# Altium schematic sheet Main.SchDoc: Three Phase ACIM Motor Control
size A3; Date: 28.08.2010; ApprovedBy: V.Gyurov; CheckedBy: V.Gyurov; Author: V.Gyurov; CompanyName: V.Gyurov; DrawnBy: V.Gyurov; Engineer: V.Gyurov; DocumentNumber: 1; Revision: 00; SheetNumber: 1; SheetTotal: 7; VersionControl_RevNumber: V1.00 R.00; CurrentDate: 28.08.2010; DocumentName: Three Phase ACIM Motor Control; ModifiedDate: 28.08.2010
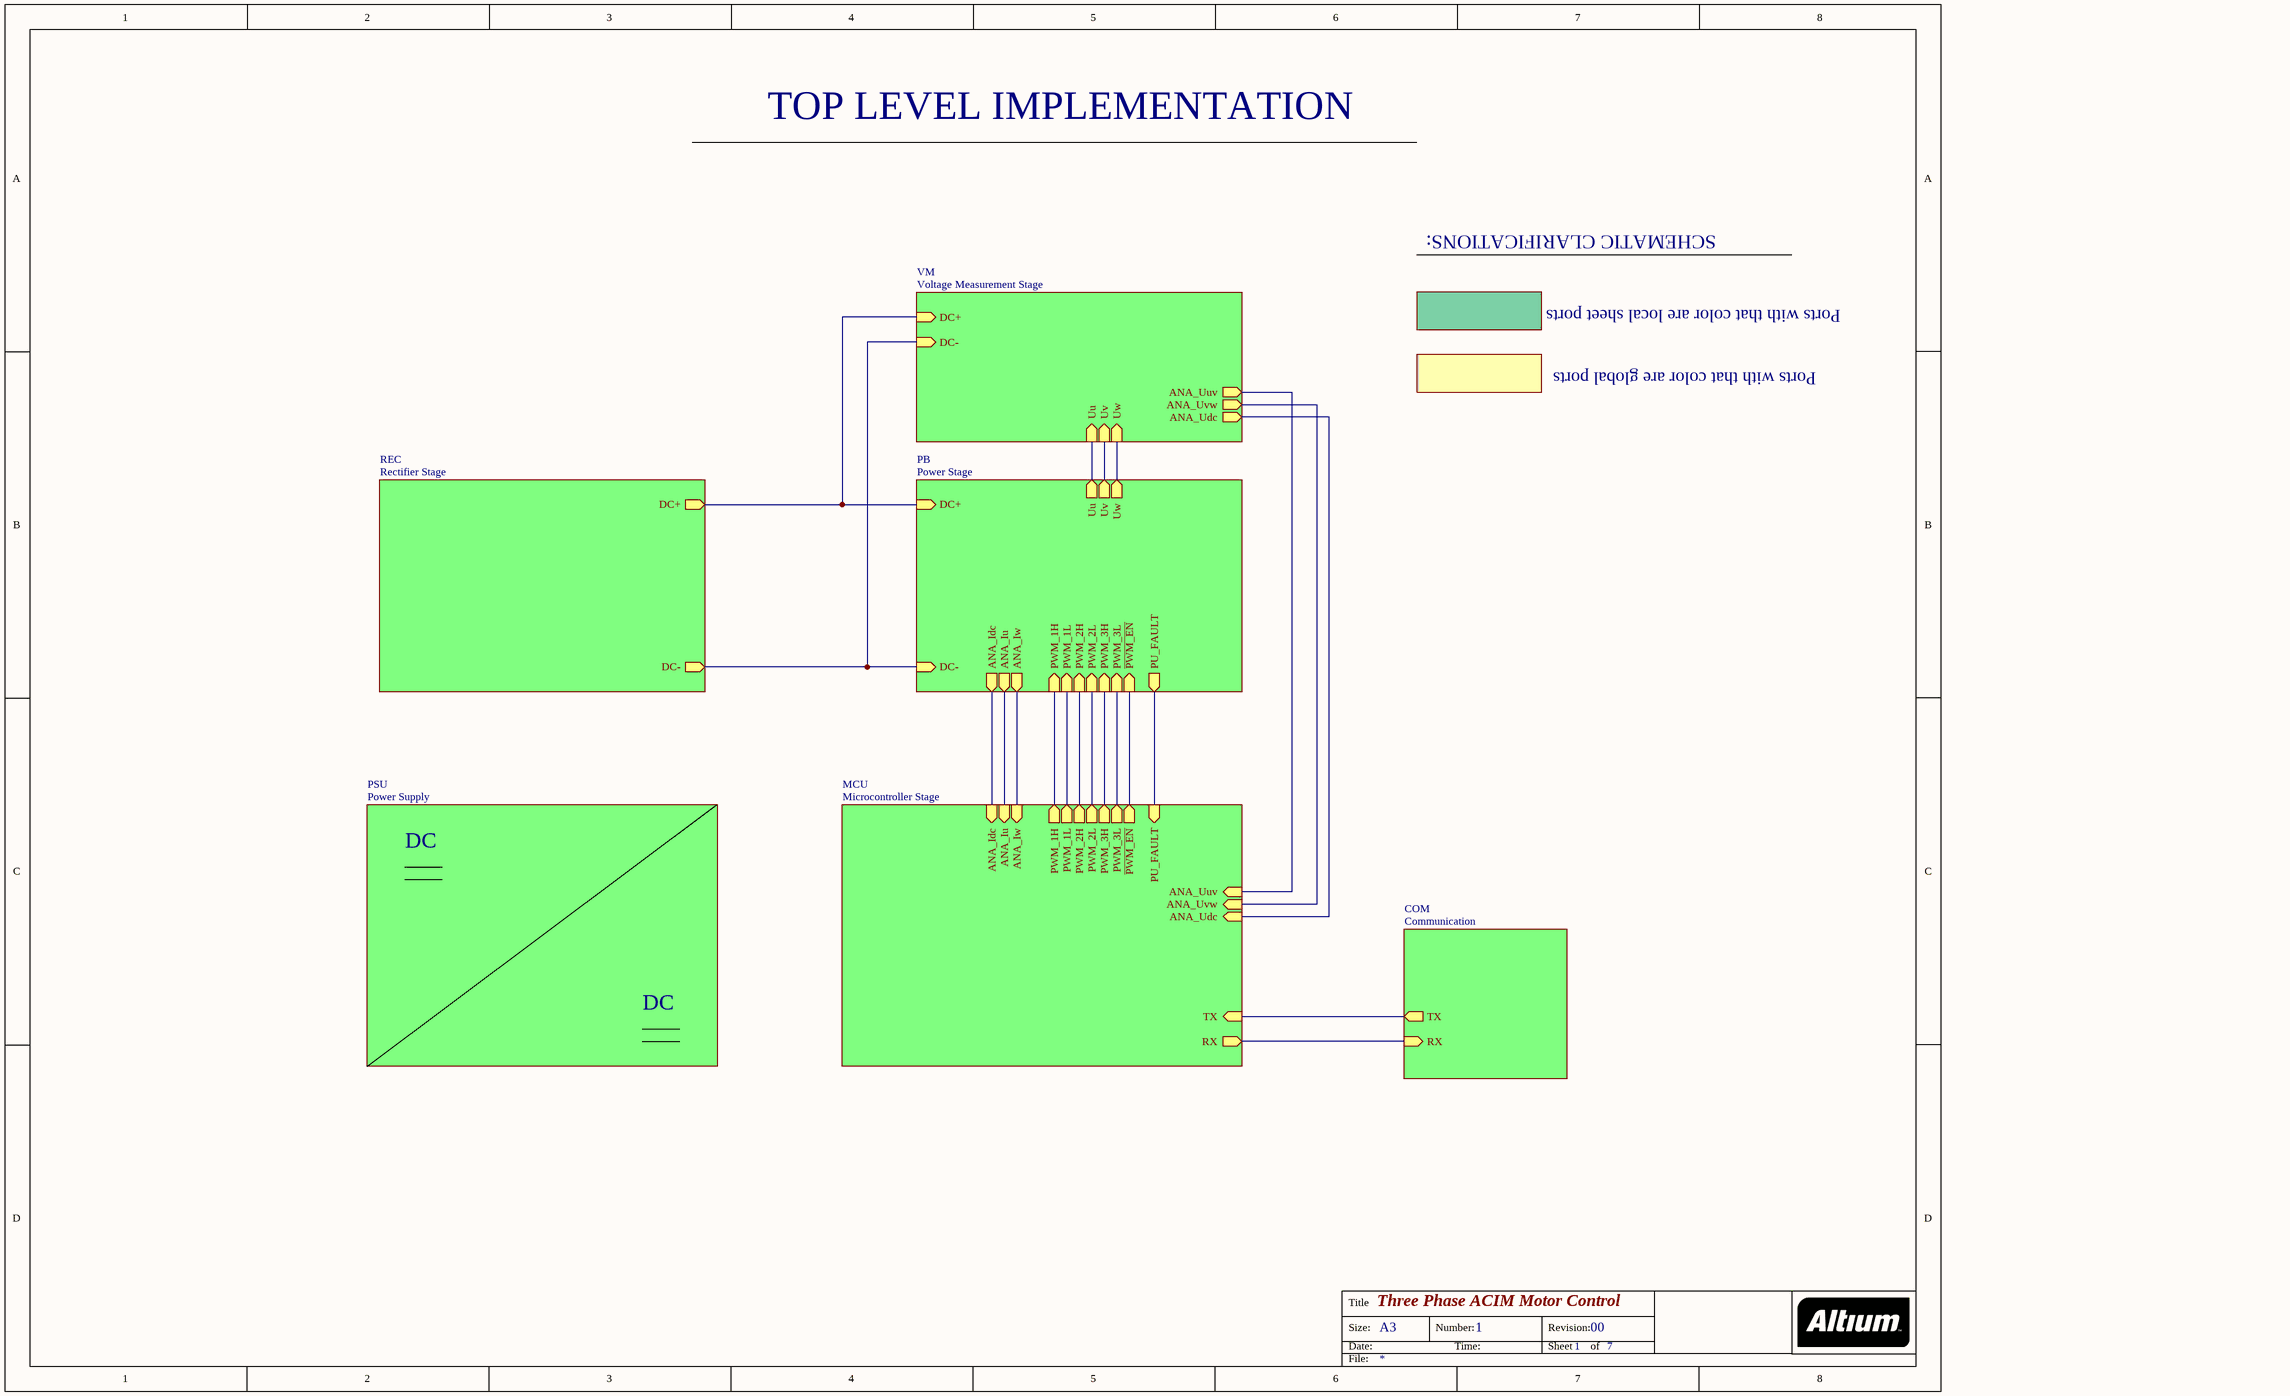
[diagram p0: Main.SchDoc]

## Sub-sheets
COM = Communication: TX (out), RX (in)
MCU = Microcontroller Stage: ANA_Idc (in), ANA_Iu (in), ANA_Iw (in), PWM_1H (out), PWM_1L (out), PWM_2H (out), PWM_2L (out), PWM_3H (out), PWM_3L (out), ~{PWM_EN} (out), PU_FAULT (in), ANA_Uuv (in), ANA_Uvw (in), TX (in), RX (out), ANA_Udc (in)
PB = Power Stage: ANA_Idc (out), PWM_1H (in), PWM_1L (in), PWM_2H (in), PWM_2L (in), PWM_3H (in), PWM_3L (in), ~{PWM_EN} (in), PU_FAULT (out), ANA_Iu (out), ANA_Iw (out), Uu (out), Uv (out), Uw (out), DC+ (in), DC- (in)
PSU = Power Supply: no entries
REC = Rectifier Stage: DC+ (out), DC- (out)
VM = Voltage Measurement Stage: Uu (in), Uv (in), Uw (in), ANA_Uuv (out), ANA_Uvw (out), DC+ (in), DC- (in), ANA_Udc (out)

## Nets
(unnamed): sheet PB/ANA_Idc, sheet MCU/ANA_Idc
(unnamed): sheet PB/PWM_1H, sheet MCU/PWM_1H
(unnamed): sheet PB/PWM_1L, sheet MCU/PWM_1L
(unnamed): sheet PB/PWM_2H, sheet MCU/PWM_2H
(unnamed): sheet PB/PWM_2L, sheet MCU/PWM_2L
(unnamed): sheet PB/PWM_3H, sheet MCU/PWM_3H
(unnamed): sheet PB/PWM_3L, sheet MCU/PWM_3L
(unnamed): sheet PB/~{PWM_EN}, sheet MCU/~{PWM_EN}
(unnamed): sheet PB/PU_FAULT, sheet MCU/PU_FAULT
(unnamed): sheet PB/ANA_Iu, sheet MCU/ANA_Iu
(unnamed): sheet PB/ANA_Iw, sheet MCU/ANA_Iw
(unnamed): sheet PB/Uu, sheet VM/Uu
(unnamed): sheet PB/Uv, sheet VM/Uv
(unnamed): sheet PB/Uw, sheet VM/Uw
(unnamed): sheet PB/DC+, sheet REC/DC+, sheet VM/DC+
(unnamed): sheet PB/DC-, sheet REC/DC-, sheet VM/DC-
(unnamed): sheet MCU/ANA_Uuv, sheet VM/ANA_Uuv
(unnamed): sheet MCU/ANA_Uvw, sheet VM/ANA_Uvw
(unnamed): sheet MCU/TX, sheet COM/TX
(unnamed): sheet MCU/RX, sheet COM/RX
(unnamed): sheet MCU/ANA_Udc, sheet VM/ANA_Udc

## Notes on the sheet
- TOP LEVEL IMPLEMENTATION
- SCHEMATIC CLARIFICATIONS:
- Ports with that color are local sheet ports
- Ports with that color are global ports
- DC
- Title
- Size:
- Date:
- A3
- Number:
- Time:
- Revision:
- Sheet
- of
- File: